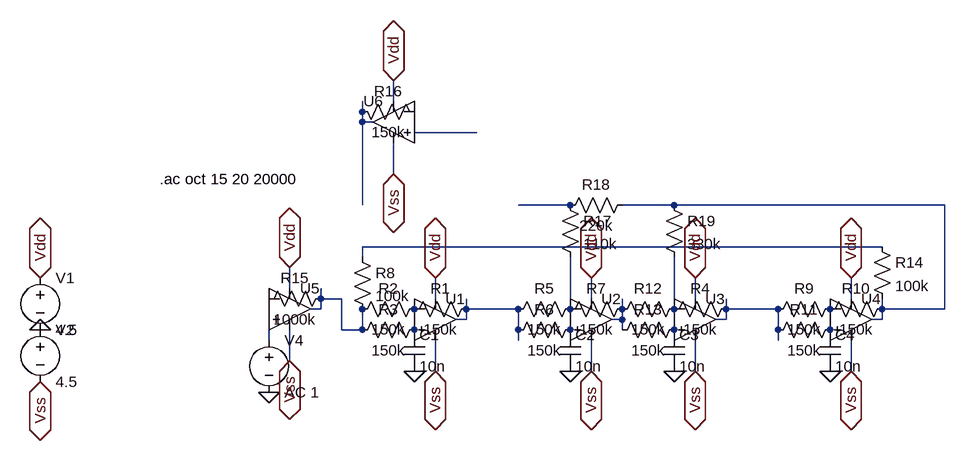
[diagram p0: schematic Cd4016phaser.asc]
Cd4016phaser.asc, the LTspice schematic file:
Version 4
SHEET 1 1236 680
WIRE 384 -224 384 -256
WIRE 336 -208 336 -224
WIRE 336 -192 336 -208
WIRE 352 -192 336 -192
WIRE 512 -176 416 -176
WIRE 384 -112 384 -160
WIRE 336 -64 336 -192
WIRE 656 -64 576 -64
WIRE 816 -64 736 -64
WIRE 1232 -64 816 -64
WIRE 1136 0 336 0
WIRE 336 16 336 0
WIRE 224 64 224 32
WIRE 272 80 272 64
WIRE 304 80 272 80
WIRE 448 80 448 48
WIRE 688 80 688 48
WIRE 848 80 848 48
WIRE 1088 80 1088 48
WIRE 272 96 272 80
WIRE 272 96 256 96
WIRE 496 96 496 80
WIRE 576 96 496 96
WIRE 656 96 656 16
WIRE 736 96 736 80
WIRE 816 96 816 16
WIRE 896 96 896 80
WIRE 976 96 896 96
WIRE 1136 96 1136 80
WIRE 1232 96 1232 -64
WIRE 1232 96 1136 96
WIRE 496 112 496 96
WIRE 496 112 480 112
WIRE 736 112 736 96
WIRE 736 112 720 112
WIRE 816 112 816 96
WIRE 896 112 896 96
WIRE 896 112 880 112
WIRE 1136 112 1136 96
WIRE 1136 112 1120 112
WIRE 304 128 304 80
WIRE 336 128 336 96
WIRE 336 128 304 128
WIRE 576 128 576 96
WIRE 736 128 736 112
WIRE 976 128 976 96
WIRE 192 144 192 112
WIRE 576 144 576 128
WIRE 976 144 976 128
WIRE 224 176 224 128
WIRE 448 192 448 144
WIRE 688 192 688 144
WIRE 848 192 848 144
WIRE 1088 192 1088 144
FLAG -160 128 0
FLAG -160 48 Vdd
IOPIN -160 48 BiDir
FLAG 448 48 Vdd
IOPIN 448 48 BiDir
FLAG -160 208 Vss
IOPIN -160 208 BiDir
FLAG 448 192 Vss
IOPIN 448 192 BiDir
FLAG 688 48 Vdd
IOPIN 688 48 BiDir
FLAG 688 192 Vss
IOPIN 688 192 BiDir
FLAG 656 192 0
FLAG 416 192 0
FLAG 848 48 Vdd
IOPIN 848 48 BiDir
FLAG 848 192 Vss
IOPIN 848 192 BiDir
FLAG 1088 48 Vdd
IOPIN 1088 48 BiDir
FLAG 1088 192 Vss
IOPIN 1088 192 BiDir
FLAG 1056 192 0
FLAG 816 192 0
FLAG 192 224 0
FLAG 224 32 Vdd
IOPIN 224 32 BiDir
FLAG 224 176 Vss
IOPIN 224 176 BiDir
FLAG 384 -256 Vdd
IOPIN 384 -256 BiDir
FLAG 384 -112 Vss
IOPIN 384 -112 BiDir
SYMBOL voltage -160 32 R0
WINDOW 123 0 0 Left 0
WINDOW 39 0 0 Left 0
SYMATTR InstName V1
SYMATTR Value 4.5
SYMBOL voltage -160 112 R0
WINDOW 123 0 0 Left 0
WINDOW 39 0 0 Left 0
SYMATTR InstName V2
SYMATTR Value 4.5
SYMBOL Opamps\\UniversalOpamp2 448 112 R0
SYMATTR InstName U1
SYMBOL cap 400 128 R0
SYMATTR InstName C1
SYMATTR Value 10n
SYMBOL res 512 80 R90
WINDOW 0 0 56 VBottom 2
WINDOW 3 32 56 VTop 2
SYMATTR InstName R1
SYMATTR Value 150k
SYMBOL res 432 80 R90
WINDOW 0 0 56 VBottom 2
WINDOW 3 32 56 VTop 2
SYMATTR InstName R2
SYMATTR Value 150k
SYMBOL res 432 112 R90
WINDOW 0 0 56 VBottom 2
WINDOW 3 32 56 VTop 2
SYMATTR InstName R3
SYMATTR Value 150k
SYMBOL res 672 80 R90
WINDOW 0 0 56 VBottom 2
WINDOW 3 32 56 VTop 2
SYMATTR InstName R5
SYMATTR Value 150k
SYMBOL Opamps\\UniversalOpamp2 688 112 R0
SYMATTR InstName U2
SYMBOL cap 640 128 R0
SYMATTR InstName C2
SYMATTR Value 10n
SYMBOL res 752 80 R90
WINDOW 0 0 56 VBottom 2
WINDOW 3 32 56 VTop 2
SYMATTR InstName R7
SYMATTR Value 150k
SYMBOL res 672 112 R90
WINDOW 0 0 56 VBottom 2
WINDOW 3 32 56 VTop 2
SYMATTR InstName R6
SYMATTR Value 150k
SYMBOL res 320 0 R0
SYMATTR InstName R8
SYMATTR Value 100k
SYMBOL Opamps\\UniversalOpamp2 848 112 R0
SYMATTR InstName U3
SYMBOL cap 800 128 R0
SYMATTR InstName C3
SYMATTR Value 10n
SYMBOL res 912 80 R90
WINDOW 0 0 56 VBottom 2
WINDOW 3 32 56 VTop 2
SYMATTR InstName R4
SYMATTR Value 150k
SYMBOL res 1072 80 R90
WINDOW 0 0 56 VBottom 2
WINDOW 3 32 56 VTop 2
SYMATTR InstName R9
SYMATTR Value 150k
SYMBOL Opamps\\UniversalOpamp2 1088 112 R0
SYMATTR InstName U4
SYMBOL cap 1040 128 R0
SYMATTR InstName C4
SYMATTR Value 10n
SYMBOL res 1152 80 R90
WINDOW 0 0 56 VBottom 2
WINDOW 3 32 56 VTop 2
SYMATTR InstName R10
SYMATTR Value 150k
SYMBOL res 1072 112 R90
WINDOW 0 0 56 VBottom 2
WINDOW 3 32 56 VTop 2
SYMATTR InstName R11
SYMATTR Value 150k
SYMBOL res 832 80 R90
WINDOW 0 0 56 VBottom 2
WINDOW 3 32 56 VTop 2
SYMATTR InstName R12
SYMATTR Value 150k
SYMBOL res 832 112 R90
WINDOW 0 0 56 VBottom 2
WINDOW 3 32 56 VTop 2
SYMATTR InstName R13
SYMATTR Value 150k
SYMBOL res 1120 -16 R0
SYMATTR InstName R14
SYMATTR Value 100k
SYMBOL voltage 192 128 R0
WINDOW 123 0 0 Left 0
WINDOW 39 0 0 Left 0
SYMATTR InstName V4
SYMATTR Value AC 1
SYMBOL Opamps\\UniversalOpamp2 224 96 R0
SYMATTR InstName U5
SYMBOL res 288 64 R90
WINDOW 0 0 56 VBottom 2
WINDOW 3 32 56 VTop 2
SYMATTR InstName R15
SYMATTR Value 1000k
SYMBOL Opamps\\UniversalOpamp2 384 -192 M0
SYMATTR InstName U6
SYMBOL res 320 -224 M90
WINDOW 0 0 56 VBottom 2
WINDOW 3 32 56 VTop 2
SYMATTR InstName R16
SYMATTR Value 150k
SYMBOL res 640 -80 R0
SYMATTR InstName R17
SYMATTR Value 110k
SYMBOL res 752 -80 R90
WINDOW 0 0 56 VBottom 2
WINDOW 3 32 56 VTop 2
SYMATTR InstName R18
SYMATTR Value 220k
SYMBOL res 800 -80 R0
SYMATTR InstName R19
SYMATTR Value 330k
TEXT 24 -104 Left 2 !.ac oct 15 20 20000

The netlist it stands for:
* Cd4016phaser.asc
V1 Vdd 0 4.5
V2 0 Vss 4.5
XU1 P001 P002 Vdd Vss N007 level.2 Avol=1Meg GBW=10Meg Slew=10Meg ilimit=25m rail=0 Vos=0 phimargin=45 en=0 enk=0 in=0 ink=0 Rin=500Meg  ; pins IN+ IN- V+ V- OUT
C1 P001 0 10n
R1 N007 P002 150k
R2 P002 N006 150k
R3 P001 N006 150k
R5 N008 N007 150k
XU2 P003 N008 Vdd Vss N009 level.2 Avol=1Meg GBW=10Meg Slew=10Meg ilimit=25m rail=0 Vos=0 phimargin=45 en=0 enk=0 in=0 ink=0 Rin=500Meg  ; pins IN+ IN- V+ V- OUT
C2 P003 0 10n
R7 N009 N008 150k
R6 P003 N007 150k
R8 N005 N006 100k
XU3 P004 N010 Vdd Vss N011 level.2 Avol=1Meg GBW=10Meg Slew=10Meg ilimit=25m rail=0 Vos=0 phimargin=45 en=0 enk=0 in=0 ink=0 Rin=500Meg  ; pins IN+ IN- V+ V- OUT
C3 P004 0 10n
R4 N011 N010 150k
R9 P005 N011 150k
XU4 P006 P005 Vdd Vss N004 level.2 Avol=1Meg GBW=10Meg Slew=10Meg ilimit=25m rail=0 Vos=0 phimargin=45 en=0 enk=0 in=0 ink=0 Rin=500Meg  ; pins IN+ IN- V+ V- OUT
C4 P006 0 10n
R10 N004 P005 150k
R11 P006 N011 150k
R12 N010 N009 150k
R13 P004 N009 150k
R14 N005 N004 100k
V4 N012 0 AC 1
XU5 N012 P007 Vdd Vss N006 level.2 Avol=1Meg GBW=10Meg Slew=10Meg ilimit=25m rail=0 Vos=0 phimargin=45 en=0 enk=0 in=0 ink=0 Rin=500Meg  ; pins IN+ IN- V+ V- OUT
R15 N006 P007 1000k
XU6 N002 P008 Vdd Vss N001 level.2 Avol=1Meg GBW=10Meg Slew=10Meg ilimit=25m rail=0 Vos=0 phimargin=45 en=0 enk=0 in=0 ink=0 Rin=500Meg  ; pins IN+ IN- V+ V- OUT
R16 N001 P008 150k
R17 N003 N008 110k
R18 N004 N003 220k
R19 N004 N010 330k
.ac oct 15 20 20000
.lib UniversalOpamps2.sub
.backanno
.end